# EAGLE schematic BrickPi 1.6 (EAGLE 6.3)
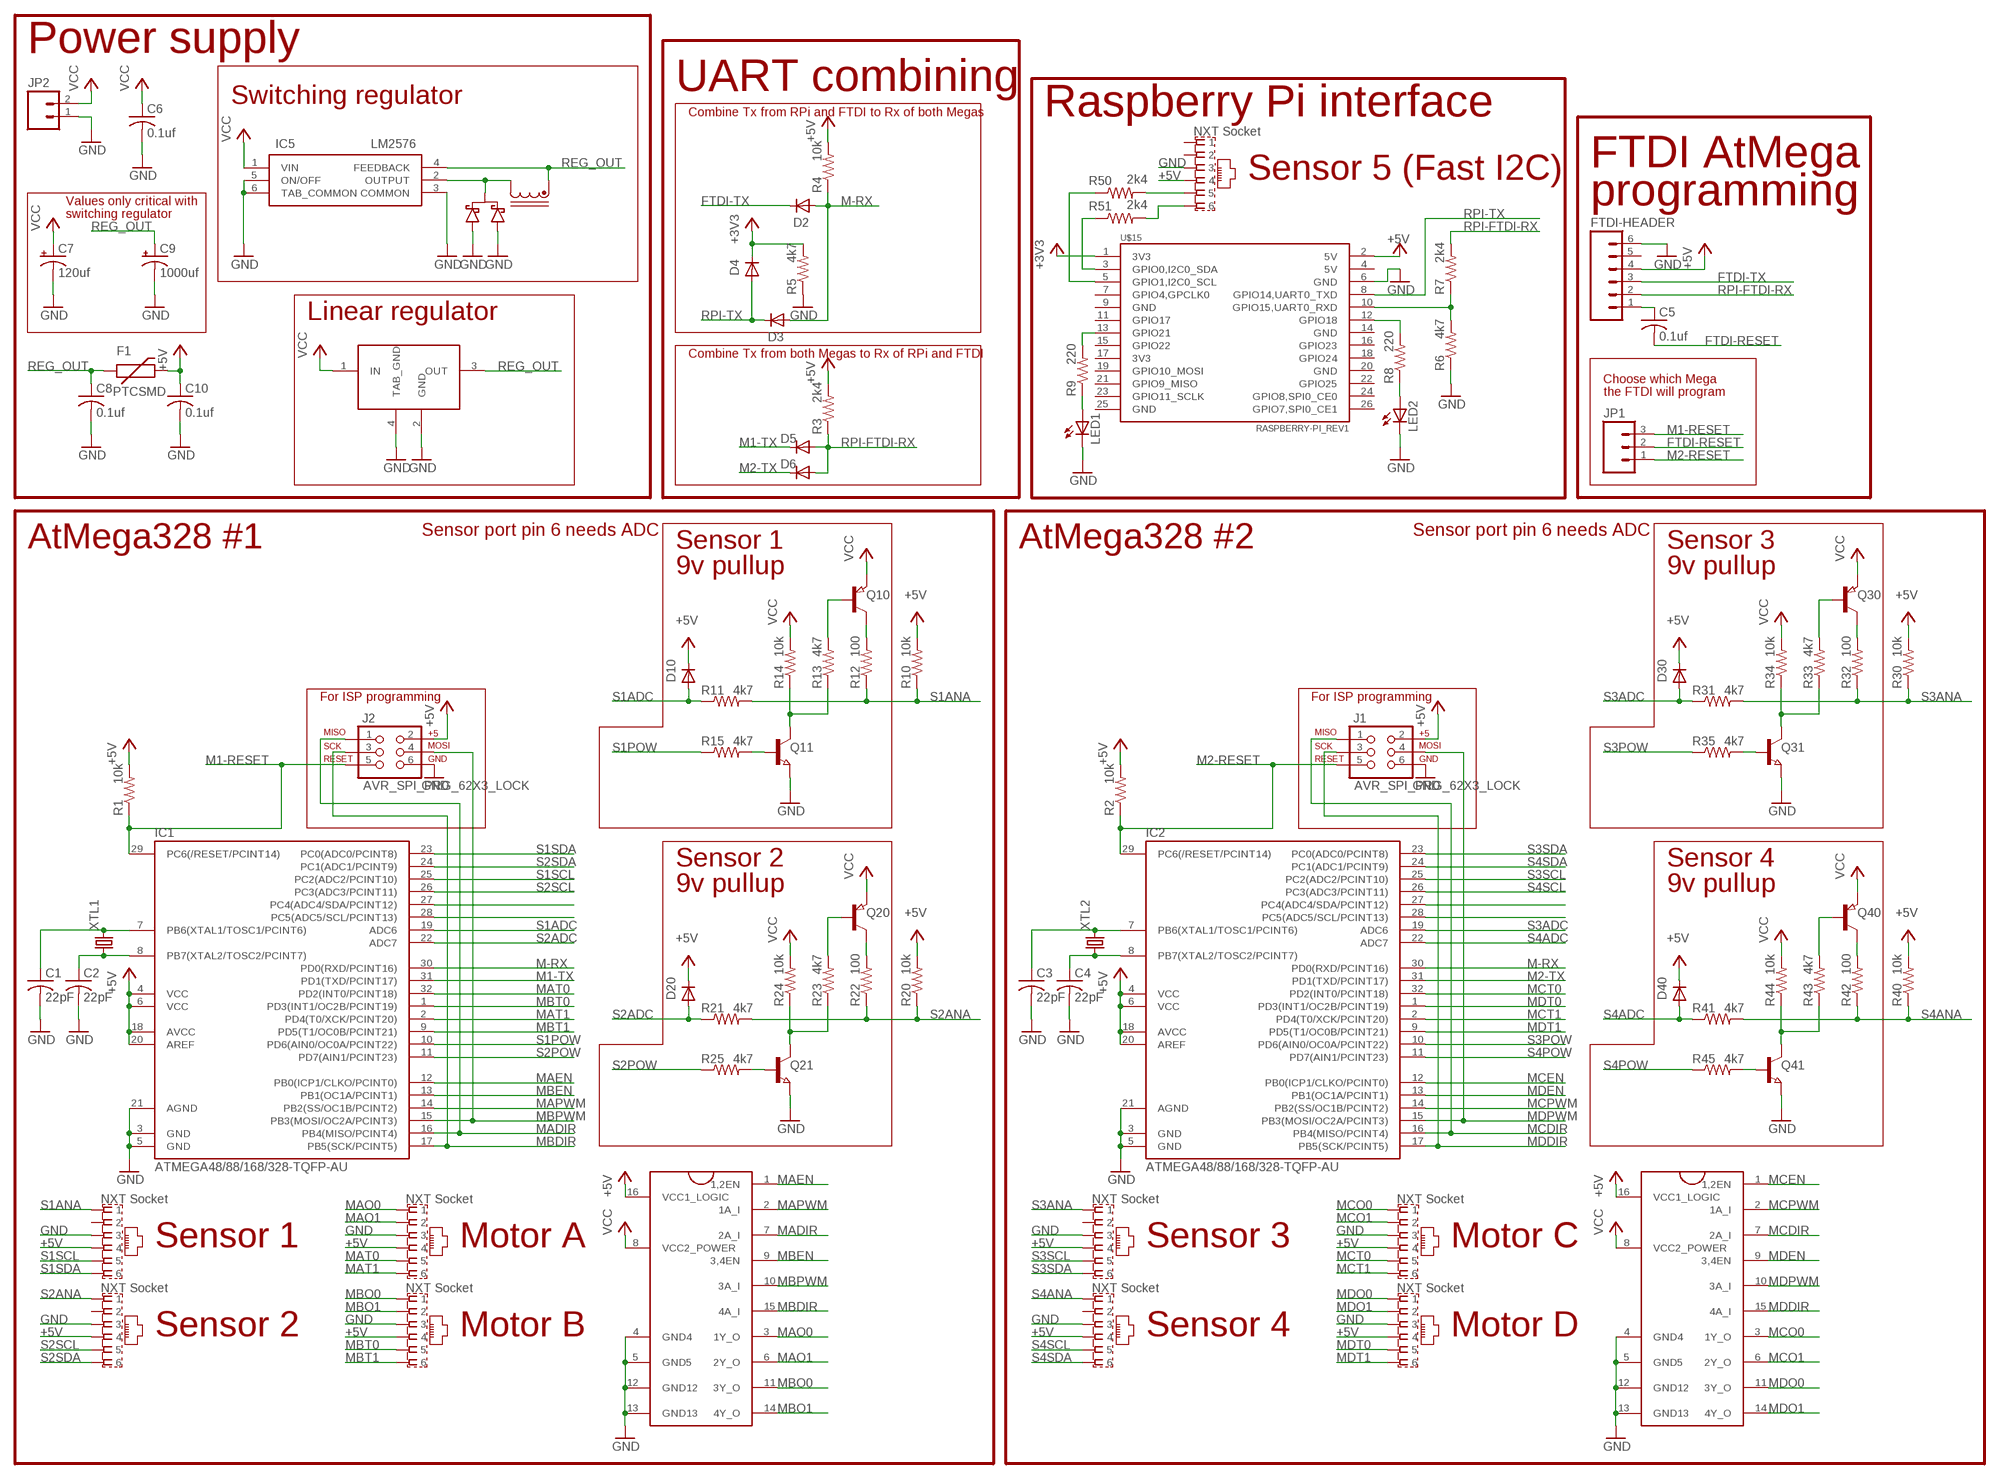
[diagram p0: schematic, sheet 1]

## Parts
C1  22pF  C-USC0805  [C0805]
C2  22pF  C-USC0805  [C0805]
C3  22pF  C-USC0805  [C0805]
C4  22pF  C-USC0805  [C0805]
C5  0.1uf  C-USC0805  [C0805]
C6  0.1uf  C-USC0805  [C0805]
C7  120uf  CPOL-USE2.5-6  [E2,5-6]
C8  0.1uf  C-USC0805  [C0805]
C9  1000uf  CPOL-USE3.5-10  [E3,5-10]
C10  0.1uf  C-USC0805  [C0805]
D1  DIODE_SCHOTTKY_VS-6CWQ04FNTRPBF  [DPAK]
D2  DIODE-SOD80C  [SOD80C]
D3  DIODE-SOD80C  [SOD80C]
D4  DIODE-SOD80C  [SOD80C]
D5  DIODE-SOD80C  [SOD80C]
D6  DIODE-SOD80C  [SOD80C]
D10  DIODE-SOD80C  [SOD80C]
D20  DIODE-SOD80C  [SOD80C]
D30  DIODE-SOD80C  [SOD80C]
D40  DIODE-SOD80C  [SOD80C]
F1  PTCSMD  [PTC-1206]
FTDI-HEADER  M06LOCK  [1X06_LOCK]
IC1  ATMEGA48/88/168/328-TQFP-AU  [TQFP32-08]
IC2  ATMEGA48/88/168/328-TQFP-AU  [TQFP32-08]
IC3  SN754410  [DIL16-ROUND-HEAT_DIS_SN754410]
IC4  SN754410  [DIL16-ROUND-HEAT_DIS_SN754410]
IC5  LM2576  REGULATOR_SWITCHING_LM2575_LM2576  [TO220-5-H]
IC6  REGULATOR_5V_TO220-H_7805  [TO220-H]
J1  AVR_SPI_PRG_62X3_LOCK  [2X3_LOCK]
J2  AVR_SPI_PRG_62X3_LOCK  [2X3_LOCK]
JP1  M03LOCK  [1X03_LOCK]
JP2  M02LOCK  [1X02_LOCK]
LED1  LED1206  [LED-1206]
LED2  LED1206  [LED-1206]
Q10  PNP-TRANSISTOR_SOT23  [SOT23]
Q11  NPN-TRANSISTOR_SOT23  [SOT23]
Q20  PNP-TRANSISTOR_SOT23  [SOT23]
Q21  NPN-TRANSISTOR_SOT23  [SOT23]
Q30  PNP-TRANSISTOR_SOT23  [SOT23]
Q31  NPN-TRANSISTOR_SOT23  [SOT23]
Q40  PNP-TRANSISTOR_SOT23  [SOT23]
Q41  NPN-TRANSISTOR_SOT23  [SOT23]
R1  10k  RESISTOR0603-RES  [0603]
R2  10k  RESISTOR0603-RES  [0603]
R3  2k4  RESISTOR0603-RES  [0603]
R4  10k  RESISTOR0603-RES  [0603]
R5  4k7  RESISTOR0603-RES  [0603]
R6  4k7  RESISTOR0603-RES  [0603]
R7  2k4  RESISTOR0603-RES  [0603]
R8  220  RESISTOR0603-RES  [0603]
R9  220  RESISTOR0603-RES  [0603]
R10  10k  RESISTOR0603-RES  [0603]
R11  4k7  RESISTOR0603-RES  [0603]
R12  100  RESISTOR0805-RES  [0805]
R13  4k7  RESISTOR0603-RES  [0603]
R14  10k  RESISTOR0603-RES  [0603]
R15  4k7  RESISTOR0603-RES  [0603]
R20  10k  RESISTOR0603-RES  [0603]
R21  4k7  RESISTOR0603-RES  [0603]
R22  100  RESISTOR0805-RES  [0805]
R23  4k7  RESISTOR0603-RES  [0603]
R24  10k  RESISTOR0603-RES  [0603]
R25  4k7  RESISTOR0603-RES  [0603]
R30  10k  RESISTOR0603-RES  [0603]
R31  4k7  RESISTOR0603-RES  [0603]
R32  100  RESISTOR0805-RES  [0805]
R33  4k7  RESISTOR0603-RES  [0603]
R34  10k  RESISTOR0603-RES  [0603]
R35  4k7  RESISTOR0603-RES  [0603]
R40  10k  RESISTOR0603-RES  [0603]
R41  4k7  RESISTOR0603-RES  [0603]
R42  100  RESISTOR0805-RES  [0805]
R43  4k7  RESISTOR0603-RES  [0603]
R44  10k  RESISTOR0603-RES  [0603]
R45  4k7  RESISTOR0603-RES  [0603]
R50  2k4  RESISTOR0603-RES  [0603]
R51  2k4  RESISTOR0603-RES  [0603]
U$3  NXT-SOCKETREGULAR  [NXT-SOCKET]
U$4  NXT-SOCKETREGULAR  [NXT-SOCKET]
U$5  NXT-SOCKETREGULAR  [NXT-SOCKET]
U$7  NXT-SOCKETREGULAR  [NXT-SOCKET]
U$8  NXT-SOCKETREGULAR  [NXT-SOCKET]
U$9  NXT-SOCKETREGULAR  [NXT-SOCKET]
U$10  NXT-SOCKETREGULAR  [NXT-SOCKET]
U$11  NXT-SOCKETREGULAR  [NXT-SOCKET]
U$12  NXT-SOCKETREGULAR  [NXT-SOCKET]
U$14  INDUCTOR_PULSE_P0250.XXXNL  [INDUCTOR_PULSE_P0250.XXXNL]
U$15  RASPBERRY-PI_REV1  [RASPBERRY-PI_REV1]
XTL1  CRYSTALHC49S  [HC49/S]
XTL2  CRYSTALHC49S  [HC49/S]

## Nets
+3V3: D4.C R5.2 U$15.1(3V3)
+5V: C10.1 D10.C D20.C D30.C D40.C F1.2 FTDI-HEADER.4 IC1.4(VCC) IC1.6(VCC) IC1.18(AVCC) IC1.20(AREF) IC2.4(VCC) IC2.6(VCC) IC2.18(AVCC) IC2.20(AREF) IC3.16(VCC1_LOGIC) IC4.16(VCC1_LOGIC) J1.2 J2.2 R1.2 R2.2 R3.2 R4.2 R10.2 R20.2 R30.2 R40.2 U$3.4 U$4.4 U$5.4 U$7.4 U$8.4 U$9.4 U$10.4 U$11.4 U$12.4 U$15.2(5V)
FTDI-RESET: C5.2 JP1.2
FTDI-TX: D2.C FTDI-HEADER.3
GND: C1.2 C2.2 C3.2 C4.2 C6.2 C7.- C8.2 C9.- C10.2 D1.1 D1.3 FTDI-HEADER.6 IC1.3(GND) IC1.5(GND) IC1.21(AGND) IC2.3(GND) IC2.5(GND) IC2.21(AGND) IC3.4(GND4) IC3.5(GND5) IC3.12(GND12) IC3.13(GND13) IC4.4(GND4) IC4.5(GND5) IC4.12(GND12) IC4.13(GND13) IC5.3(COMMON) IC5.5(ON/OFF) IC5.6(TAB_COMMON) IC6.2(GND) IC6.4(TAB_GND) J1.6 J2.6 JP2.1 LED1.C LED2.C Q11.2(E) Q21.2(E) Q31.2(E) Q41.2(E) R5.1 R6.1 U$3.3 U$4.3 U$5.3 U$7.3 U$8.3 U$9.3 U$10.3 U$11.3 U$12.3 U$15.6(GND)
M1-RESET: IC1.29(PC6(/RESET/PCINT14)) J2.5 JP1.3 R1.1
M1-TX: D5.C IC1.31(PD1(TXD/PCINT17))
M2-RESET: IC2.29(PC6(/RESET/PCINT14)) J1.5 JP1.1 R2.1
M2-TX: D6.C IC2.31(PD1(TXD/PCINT17))
M-RX: D2.A D3.A IC1.30(PD0(RXD/PCINT16)) IC2.30(PD0(RXD/PCINT16)) R4.1
MADIR: IC1.16(PB4(MISO/PCINT4)) IC3.7(2A_I) J2.1
MAEN: IC1.12(PB0(ICP1/CLKO/PCINT0)) IC3.1(1,2EN)
MAO0: IC3.3(1Y_O) U$3.1
MAO1: IC3.6(2Y_O) U$3.2
MAPWM: IC1.14(PB2(SS/OC1B/PCINT2)) IC3.2(1A_I)
MAT0: IC1.32(PD2(INT0/PCINT18)) U$3.5
MAT1: IC1.2(PD4(T0/XCK/PCINT20)) U$3.6
MBDIR: IC1.17(PB5(SCK/PCINT5)) IC3.15(4A_I) J2.3
MBEN: IC1.13(PB1(OC1A/PCINT1)) IC3.9(3,4EN)
MBO0: IC3.11(3Y_O) U$4.1
MBO1: IC3.14(4Y_O) U$4.2
MBPWM: IC1.15(PB3(MOSI/OC2A/PCINT3)) IC3.10(3A_I) J2.4
MBT0: IC1.1(PD3(INT1/OC2B/PCINT19)) U$4.5
MBT1: IC1.9(PD5(T1/OC0B/PCINT21)) U$4.6
MCDIR: IC2.16(PB4(MISO/PCINT4)) IC4.7(2A_I) J1.1
MCEN: IC2.12(PB0(ICP1/CLKO/PCINT0)) IC4.1(1,2EN)
MCO0: IC4.3(1Y_O) U$5.1
MCO1: IC4.6(2Y_O) U$5.2
MCPWM: IC2.14(PB2(SS/OC1B/PCINT2)) IC4.2(1A_I)
MCT0: IC2.32(PD2(INT0/PCINT18)) U$5.5
MCT1: IC2.2(PD4(T0/XCK/PCINT20)) U$5.6
MDDIR: IC2.17(PB5(SCK/PCINT5)) IC4.15(4A_I) J1.3
MDEN: IC2.13(PB1(OC1A/PCINT1)) IC4.9(3,4EN)
MDO0: IC4.11(3Y_O) U$7.1
MDO1: IC4.14(4Y_O) U$7.2
MDPWM: IC2.15(PB3(MOSI/OC2A/PCINT3)) IC4.10(3A_I) J1.4
MDT0: IC2.1(PD3(INT1/OC2B/PCINT19)) U$7.5
MDT1: IC2.9(PD5(T1/OC0B/PCINT21)) U$7.6
N$1: D1.4 IC5.2(OUTPUT) U$14.P$2
N$2: C5.1 FTDI-HEADER.1
N$3: LED2.A R8.1
N$4: LED1.A R9.1
N$5: C1.1 IC1.7(PB6(XTAL1/TOSC1/PCINT6)) XTL1.2
N$6: R9.2 U$15.13(GPIO21)
N$7: C2.1 IC1.8(PB7(XTAL2/TOSC2/PCINT7)) XTL1.1
N$8: Q11.1(B) R15.2
N$9: Q20.3(C) R22.2
N$10: Q21.1(B) R25.2
N$11: R6.2 R7.1 U$15.10(GPIO15,UART0_RXD)
N$12: R8.2 U$15.12(GPIO18)
N$13: Q11.3(C) R13.1 R14.1
N$14: C3.1 IC2.7(PB6(XTAL1/TOSC1/PCINT6)) XTL2.2
N$15: C4.1 IC2.8(PB7(XTAL2/TOSC2/PCINT7)) XTL2.1
N$16: Q21.3(C) R23.1 R24.1
N$17: Q20.1(B) R23.2
N$18: IC2.27(PC4(ADC4/SDA/PCINT12))
N$19: IC2.28(PC5(ADC5/SCL/PCINT13))
N$20: Q30.3(C) R32.2
N$21: Q31.1(B) R35.2
N$22: Q10.1(B) R13.2
N$23: Q31.3(C) R33.1 R34.1
N$24: Q30.1(B) R33.2
N$25: Q10.3(C) R12.2
N$26: Q40.3(C) R42.2
N$27: IC1.27(PC4(ADC4/SDA/PCINT12))
N$28: IC1.28(PC5(ADC5/SCL/PCINT13))
N$29: R50.2 U$12.5
N$30: R51.2 U$12.6
N$31: R51.1 U$15.3(GPIO0,I2C0_SDA)
N$32: R50.1 U$15.5(GPIO1,I2C0_SCL)
N$33: Q41.1(B) R45.2
N$34: Q41.3(C) R43.1 R44.1
N$35: Q40.1(B) R43.2
REG_OUT: C8.1 C9.+ F1.1 IC5.4(FEEDBACK) IC6.3(OUT) U$14.P$1
RPI-FTDI-RX: D5.A D6.A FTDI-HEADER.2 R3.1 R7.2
RPI-TX: D3.C D4.A U$15.8(GPIO14,UART0_TXD)
S1ADC: D10.A IC1.19(ADC6) R11.1
S1ANA: R10.1 R11.2 R12.1 U$8.1
S1POW: IC1.10(PD6(AIN0/OC0A/PCINT22)) R15.1
S1SCL: IC1.25(PC2(ADC2/PCINT10)) U$8.5
S1SDA: IC1.23(PC0(ADC0/PCINT8)) U$8.6
S2ADC: D20.A IC1.22(ADC7) R21.1
S2ANA: R20.1 R21.2 R22.1 U$9.1
S2POW: IC1.11(PD7(AIN1/PCINT23)) R25.1
S2SCL: IC1.26(PC3(ADC3/PCINT11)) U$9.5
S2SDA: IC1.24(PC1(ADC1/PCINT9)) U$9.6
S3ADC: D30.A IC2.19(ADC6) R31.1
S3ANA: R30.1 R31.2 R32.1 U$10.1
S3POW: IC2.10(PD6(AIN0/OC0A/PCINT22)) R35.1
S3SCL: IC2.25(PC2(ADC2/PCINT10)) U$10.5
S3SDA: IC2.23(PC0(ADC0/PCINT8)) U$10.6
S4ADC: D40.A IC2.22(ADC7) R41.1
S4ANA: R40.1 R41.2 R42.1 U$11.1
S4POW: IC2.11(PD7(AIN1/PCINT23)) R45.1
S4SCL: IC2.26(PC3(ADC3/PCINT11)) U$11.5
S4SDA: IC2.24(PC1(ADC1/PCINT9)) U$11.6
VCC: C6.1 C7.+ IC3.8(VCC2_POWER) IC4.8(VCC2_POWER) IC5.1(VIN) IC6.1(IN) JP2.2 Q10.2(E) Q20.2(E) Q30.2(E) Q40.2(E) R14.2 R24.2 R34.2 R44.2
Unconnected: FTDI-HEADER.5 U$8.2 U$9.2 U$10.2 U$11.2 U$12.1 U$12.2 U$15.4(5V) U$15.7(GPIO4,GPCLK0) U$15.9(GND) U$15.11(GPIO17) U$15.14(GND) U$15.15(GPIO22) U$15.16(GPIO23) U$15.17(3V3) U$15.18(GPIO24) U$15.19(GPIO10_MOSI) U$15.20(GND) U$15.21(GPIO9_MISO) U$15.22(GPIO25) U$15.23(GPIO11_SCLK) U$15.24(GPIO8,SPI0_CE0) U$15.25(GND) U$15.26(GPIO7,SPI0_CE1)

## Notes on the sheet
- Power supply
- UART combining
- Switching regulator
- Combine Tx from RPi and FTDI to Rx of both Megas | Raspberry Pi interface
- FTDI AtMega
- Sensor 5 (Fast I2C)
- Values only critical with | programming
- switching regulator
- Linear regulator
- Combine Tx from both Megas to Rx of RPi and FTDI
- Choose which Mega
- the FTDI will program
- Sensor port pin 6 needs ADC | Sensor port pin 6 needs ADC
- AtMega328 #1 | Sensor 1 | AtMega328 #2 | Sensor 3
- 9v pullup | 9v pullup
- For ISP programming | For ISP programming
- Sensor 2 | Sensor 4
- 9v pullup | 9v pullup
- Sensor 1 | Motor A | Sensor 3 | Motor C
- Sensor 2 | Motor B | Sensor 4 | Motor D

## Library data of the parts
C1-C6 C8 C10 = rcl:C-US: CAPACITOR, American symbol
C7 C9 = rcl:CPOL-US: POLARIZED CAPACITOR, American symbol
D1 = zz My Parts:DIODE_SCHOTTKY_VS-6CWQ04FNTRPBF
D2-D6 D10 D20 D30 D40 = diode:DIODE-: DIODE
F1 = zz SparkFun:PTC: Resettable Fuse PTC Resettable Fuse. Spark Fun Electronics SKU : COM-08357
FTDI-HEADER = zz SparkFun:M06: Header 6 Standard 6-pin 0.1" header. Use with straight break away headers (SKU : PRT-00116), right angle break away headers (PRT-00553), swiss pins (PRT-00743), machine pins (PRT-00117), and female headers (PRT-00115). Molex polarized connector foot print use with SKU : PRT-08094 with associated crimp pins and housings. NOTES ON THE VARIANTS LOCK and LOCK_LONGPADS... This footprint was designed to help hold the alignment of a through-hole component (i.e. 6-pin header) while soldering it into place. You may notice that each hole has been shifted either up or down by 0.005 of an inch from it's more standard position (which is a perfectly straight line). This slight alteration caused the pins (the squares in the middle) to touch the edges of the holes. Because they are alternating, it causes a "brace" to hold the component in place. 0.005 has proven to be the perfect amount of "off-center" position when using our standard breakaway headers. Although looks a little odd when you look at the bare footprint, once you have a header in there, the alteration is very hard to notice. Also, if you push a header all the way into place, it is covered up entirely on the bottom side. This idea of altering the position of holes to aid alignment will be further integrated into the Sparkfun Library for other footprints. It can help hold any component with 3 or more connection pins.
IC1 IC2 = zz My Parts:ATMEGA48/88/168/328-TQFP
IC3 IC4 = zz My Parts:SN754410
IC5 = zz My Parts:REGULATOR_SWITCHING_LM2575_LM2576
IC6 = zz My Parts:REGULATOR_5V_TO220-H_7805
J1 J2 = zz My Parts:AVR_SPI_PRG_6: AVR ISP 6 Pin This is the reduced ISP connector for AVR programming. Common on Arduino. This footprint will take up less PCB space and can be used with a 10-pin to 6-pin adapter such as SKU: BOB-08508
JP1 = zz SparkFun:M03: Header 3 Standard 3-pin 0.1" header. Use with straight break away headers (SKU : PRT-00116), right angle break away headers (PRT-00553), swiss pins (PRT-00743), machine pins (PRT-00117), and female headers (PRT-00115). Molex polarized connector foot print use with SKU : PRT-08232 with associated crimp pins and housings.
JP2 = zz SparkFun:M02: Header 2 Standard 2-pin 0.1" header. Use with straight break away headers (SKU : PRT-00116), right angle break away headers (PRT-00553), swiss pins (PRT-00743), machine pins (PRT-00117), and female headers (PRT-00115). Molex polarized connector foot print use with SKU : PRT-08233 with associated crimp pins and housings.
LED1 LED2 = SparkFun-LED:LED: LEDs Standard schematic elements and footprints for 5mm, 3mm, 1206, and 0603 sized LEDs. 5mm - Spark Fun Electronics SKU : COM-00529 (and others)
Q10 Q20 Q30 Q40 = semicon-smd-ipc:PNP-TRANSISTOR_: PNP TRANSISTOR
Q11 Q21 Q31 Q41 = semicon-smd-ipc:NPN-TRANSISTOR_: NPN TRANSISTOR
R1-R15 R20-R25 R30-R35 R40-R45 R50 R51 = zz My Parts:RESISTOR: Resistor Basic schematic elements and footprints for resistors. 0603 and 0805 are mine.
U$3-U$5 U$7-U$12 = zz My Parts:NXT-SOCKET: NXT Socket
U$14 = zz My Parts:INDUCTOR_PULSE_P0250.XXXNL
U$15 = RaspberryPi:RASPBERRY-PI_REV1: Raspberry Pi Board <http://www.raspberrypi.org/> Jacques Lagnel V1.0 (beta) 2012 Mateusz Bawaj V1.1 (beta) 2012 Board dimension: Forum 3D model <http://www.raspberrypi.org/forum/general-discussion/mechanical-profile-3d-models?value=3d%20model&type=1&include=1&search=1&ret=all> The GPIO Connector (P1): http://elinux.org/RPi_Low-level_peripherals
XTL1 XTL2 = crystal:CRYSTAL: CRYSTAL; OC_FARNELL: 1667008; OC_NEWARK: unknown